# EAGLE design PhotoInterrupter (EAGLE 7.6.0)
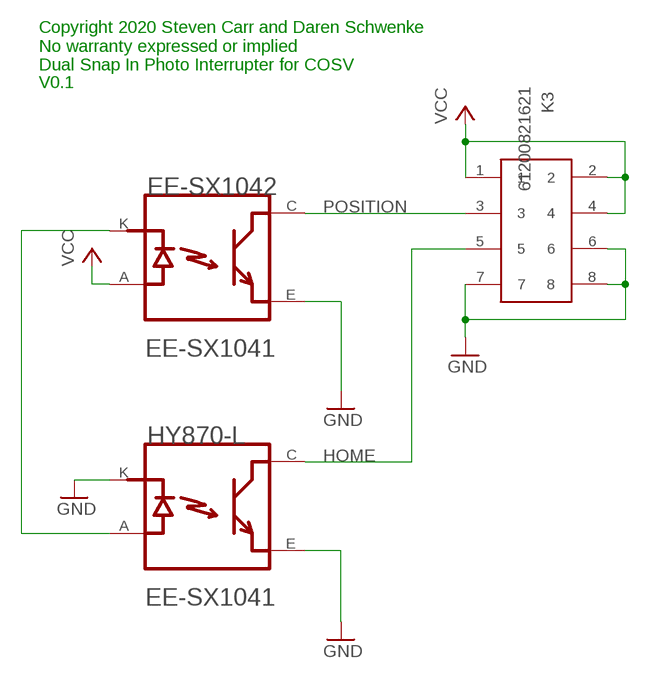
[diagram p0: schematic, sheet 1]

## Parts
EE-SX1042  OMRON_ELECTRONICS_INC-EMC_DIV_EE-SX1041OMRON_ELECTRONICS_INC-EMC_DIV_EE-SX1041_0_0  [OMRON_ELECTRONICS_INC-EMC_DIV_EE-SX1041_0]
HY870-L  OMRON_ELECTRONICS_INC-EMC_DIV_EE-SX1041OMRON_ELECTRONICS_INC-EMC_DIV_EE-SX1041_0_0  [OMRON_ELECTRONICS_INC-EMC_DIV_EE-SX1041_0]
K3  61200821621  [61200821621]

## Nets
GND: EE-SX1042.E HY870-L.E HY870-L.K K3.6 K3.7 K3.8
HOME: HY870-L.C K3.5
N$1: EE-SX1042.K HY870-L.A
POSITION: EE-SX1042.C K3.3
VCC: EE-SX1042.A K3.1 K3.2 K3.4

## Notes on the sheet
- Copyright 2020 Steven Carr and Daren Schwenke
  No warranty expressed or implied
  Dual Snap In Photo Interrupter for COSV
- V0.1

## Library data of the parts
EE-SX1042 HY870-L = PhotoInterrupter:OMRON_ELECTRONICS_INC-EMC_DIV_EE-SX1041: SENSOR OPT SLOT PHOTOTRAN PCB MT; AMBIENT_TEMPERATURE_RANGE_HIGH: +95°C; AMBIENT_TEMPERATURE_RANGE_LOW: -25°C; AUTOMOTIVE: No; CENTROID_NOT_SPECIFIED: No; DATASHEET: https://omronfs.omron.com/en_US/ecb/products/pdf/en-ee_sx1041.pdf; DEVICE_CLASS_L1: Sensors; DEVICE_CLASS_L2: Optical Sensors; DEVICE_CLASS_L3: Photoelectric Sensors; DIGIKEY_DESCRIPTION: IC SENSOR OPT SLOT PHOTOTRAN PCB MT; DIGIKEY_PART_NUMBER: OR625-ND; FOOTPRINT_VARIANT_NAME_0: Recommended_Land_Pattern; HEIGHT: 11mm; LEAD_FREE: Yes; MF: Omron Electronics Inc-EMC Div; MFG_PACKAGE_IDENT: EE-SX1041; MFG_PACKAGE_IDENT_DATE: 0; MFG_PACKAGE_IDENT_REV: 0; MOUSER_DESCRIPTION: Optical Switches, Transmissive, Phototransistor Output TRANS PHOTOTRANSISTR; MOUSER_PART_NUMBER: 653-EE-SX1041; MPN: EE-SX1041; OUTPUT_CURRENT: 20mA; PACKAGE: PTH_14MM4_6MM0; PREFIX: U; ROHS: Yes; SENSOR_OUTPUT: Other; STANDOFF_HEIGHT: 0.6mm; TEMPERATURE_RANGE_HIGH: +95°C; TEMPERATURE_RANGE_LOW: -25°C; VERIFICATION_VERSION: 0.0.0.3
K3 = Wuerth_Elektronik_eiCan_05_Box_Header_IDC_Connectors_1_2:61200821621: WR-BHD 2.54mm Male Box Header, 8 Pins

## Board
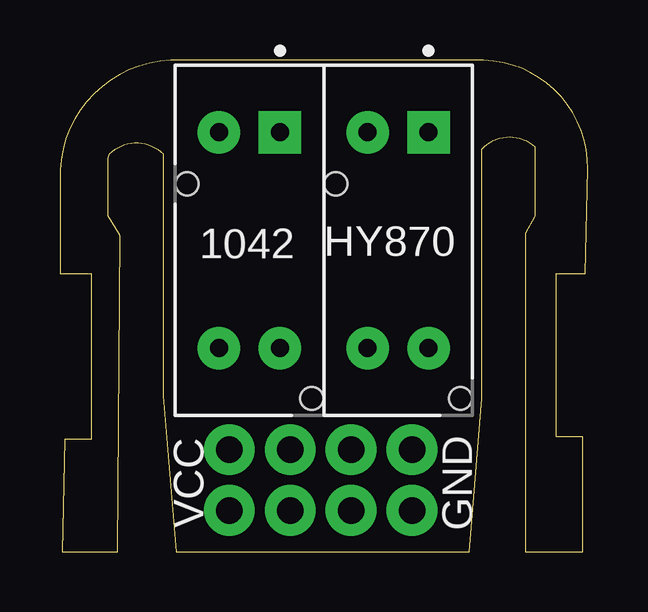
[diagram p1: board, top side]
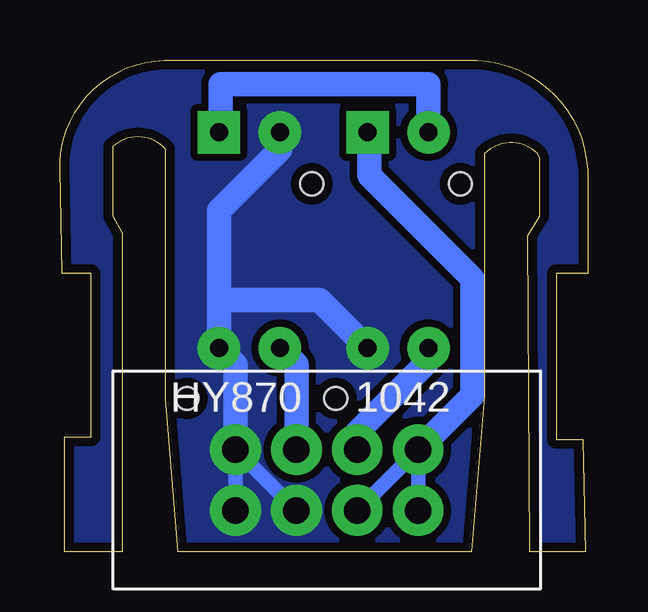
[diagram p2: board, bottom side, seen from below]

Size 22 x 20.5 mm. Coordinates in mm from the lower left corner, seen from the top.
Outline: 4.84,0 17.07,0 17.6,6.4 17.6,16.8 arc-90 19.8,16.9 19.8,14 19.4,13.3 19.4,0 21.8,0 21.8,4.8 20.7,4.8 20.7,11.6 21.9,11.6 22,15.96 arc90 17.65,20.5 5.06,20.5 arc90 0,15.92 0,11.6 1.3,11.6 1.3,4.7 0.2,4.7 0.1,0 2.4,0 2.5,13.2 2,14 2,16.43 2.07,16.6 arc-90 4.3,16.6 4.3,6.5 4.84,0
Copper layers (1*16): Top 0.035559375mm / dielectric 1.6mm / Bottom 0.035559375mm
Design rules "oshpark-2layer *": minimum track width 6mil, minimum drill 10mil, track to track 6mil, track to pad 6mil, pad to pad 6mil, via to via 6mil, smd to smd 6mil, copper to edge 15mil, drill to drill 6mil, minimum pad ring 20mil, minimum via ring 5mil, stop-mask expansion 2.5mil, vias tented up to drill 0mil, thermal gap 10mil

### Footprints (pad centres in the part's own frame; a part is rotated, then mirrored left to right if it is on the bottom)
OMRON_ELECTRONICS_INC-EMC_DIV_EE-SX1041_0 = drill 0.75 pad 1.25 square: A -4.5,1.27 | drill 0.75 pad 1.25: C 4.5,-1.27; E 4.5,1.27; K -4.5,-1.27 | hole 0.95: -2.35,-2.6; 6.6,2.6
61200821621 = drill 1.1: 1 -2.54,-1.27; 2 -2.54,1.27; 3 0,-1.27; 4 0,1.27; 5 2.54,-1.27; 6 2.54,1.27; 7 5.08,-1.27; 8 5.08,1.27

### Placement (x,y rotation side)
EE-SX1042  7.9,13 270 top
HY870-L  14.1,13 270 top
K3  9.6,3 180 bottom

### Tracks (layer width: path | path; a pad name or v marks a point on that pad's centre or on a via)
GND
  Bottom 0.61: K3.6 K3.7 K3.8
  Bottom 1.016: HY870-L.K 12.83,16.77 15.37,14.23 15.37,10.5 | HY870-L.E 15.37,10.5 | 15.12,8.25 HY870-L.E | EE-SX1042.E 11.17,10.5 15.37,10.5 | K3.7 14.68,7.81 HY870-L.E
  pour Bottom (isolate 0.305, no thermals): 4.8,0 17.1,0 17.7,6.5 17.7,16.3 17.6,16.9 19.8,16.9 19.9,13.9 19.4,13.4 19.3,0 21.7,0 21.8,4.4 21.7,4.4 21.7,4.6 20.7,4.6 20.7,11.5 21.9,11.5 21.9,16.2 21.8,16.2 21.8,16.8 arc90 17.6,20.4 4.1,20.4 arc90 0.1,16 0.1,11.8 1.4,11.8 1.4,4.5 0.3,4.5 0.2,-0.1 2.4,-0.1 2.4,13.2 2,13.6 2,16.7 4.3,16.7 4.2,6.3
HOME
  Bottom 1.016: 12.58,8.25 HY870-L.C 12.14,7.81 K3.5
N$1
  Bottom 1.016: EE-SX1042.K 6.63,19.5 15.3,19.5 15.3,17.5 HY870-L.A
POSITION
  Bottom 1.016: K3.3 9.6,5 6.7,7.9 6.7,8.43 EE-SX1042.C
VCC
  Bottom 0.61: K3.4 K3.1 K3.2
  Bottom 1.016: EE-SX1042.A 9.1,17.43 9.1,15.7 4.8,11.4 4.8,6.53 K3.1

### Text on the board
tNames: 1042 | HY870 | VCC | GND
bNames: 1042 | HY870